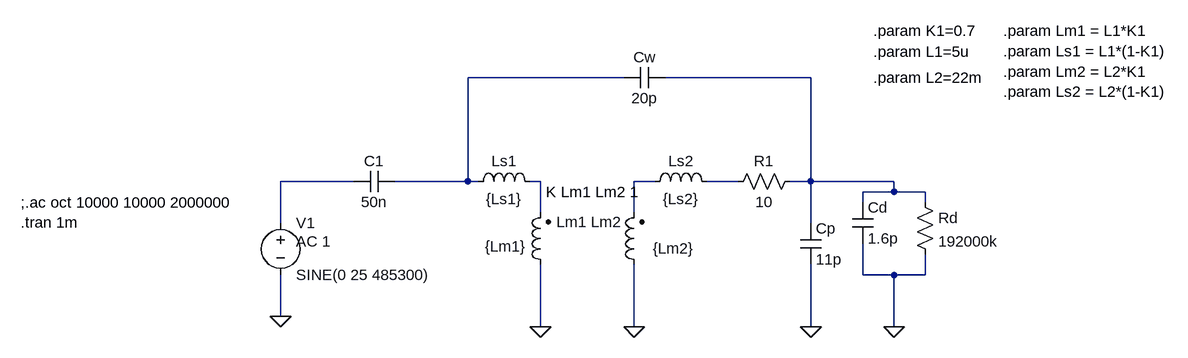
[diagram p0: schematic resonant_H_bridge - linear.asc]
resonant_H_bridge - linear.asc, the LTspice schematic file:
Version 4
SHEET 1 1716 680
WIRE 848 -352 608 -352
WIRE 1136 -352 912 -352
WIRE 432 -192 320 -192
WIRE 608 -192 608 -352
WIRE 608 -192 496 -192
WIRE 624 -192 608 -192
WIRE 720 -192 704 -192
WIRE 896 -192 864 -192
WIRE 1024 -192 976 -192
WIRE 1136 -192 1136 -352
WIRE 1136 -192 1104 -192
WIRE 1264 -192 1136 -192
WIRE 1264 -176 1264 -192
WIRE 1264 -176 1216 -176
WIRE 1312 -176 1264 -176
WIRE 1216 -160 1216 -176
WIRE 1312 -160 1312 -176
WIRE 720 -144 720 -192
WIRE 864 -144 864 -192
WIRE 320 -128 320 -192
WIRE 1136 -128 1136 -192
WIRE 1216 -48 1216 -96
WIRE 1264 -48 1216 -48
WIRE 1312 -48 1312 -80
WIRE 1312 -48 1264 -48
WIRE 320 16 320 -48
WIRE 720 32 720 -64
WIRE 864 32 864 -64
WIRE 1136 32 1136 -64
WIRE 1264 32 1264 -48
FLAG 1264 32 0
FLAG 1136 32 0
FLAG 864 32 0
FLAG 720 32 0
FLAG 320 16 0
SYMBOL ind2 736 -48 R180
WINDOW 0 -56 82 Left 2
WINDOW 3 38 44 Left 2
SYMATTR InstName Lm1
SYMATTR Value {Lm1}
SYMATTR Type ind
SYMBOL ind2 880 -48 R180
WINDOW 0 35 82 Left 2
WINDOW 3 -77 41 Left 2
SYMATTR InstName Lm2
SYMATTR Value {Lm2}
SYMATTR Type ind
SYMBOL res 1120 -208 R90
WINDOW 0 0 56 VBottom 2
WINDOW 3 32 56 VTop 2
SYMATTR InstName R1
SYMATTR Value 10
SYMBOL cap 1120 -128 R0
SYMATTR InstName Cp
SYMATTR Value 11p
SYMBOL cap 1200 -160 R0
SYMATTR InstName Cd
SYMATTR Value 1.6p
SYMBOL res 1296 -176 R0
SYMATTR InstName Rd
SYMATTR Value 192000k
SYMBOL cap 496 -208 R90
WINDOW 0 0 32 VBottom 2
WINDOW 3 32 32 VTop 2
SYMATTR InstName C1
SYMATTR Value 50n
SYMBOL voltage 320 -144 R0
WINDOW 123 24 44 Left 2
WINDOW 39 0 0 Left 0
SYMATTR Value2 AC 1
SYMATTR InstName V1
SYMATTR Value SINE(0 25 485300)
SYMBOL cap 912 -368 R90
WINDOW 0 0 32 VBottom 2
WINDOW 3 32 32 VTop 2
SYMATTR InstName Cw
SYMATTR Value 20p
SYMBOL ind 608 -176 R270
WINDOW 0 32 56 VTop 2
WINDOW 3 5 56 VBottom 2
SYMATTR InstName Ls1
SYMATTR Value {Ls1}
SYMBOL ind 880 -176 R270
WINDOW 0 32 56 VTop 2
WINDOW 3 5 56 VBottom 2
SYMATTR InstName Ls2
SYMATTR Value {Ls2}
TEXT 728 -176 Left 2 !K Lm1 Lm2 1
TEXT -80 -160 Left 2 !;.ac oct 10000 10000 2000000\n.tran 1m
TEXT 1232 -424 Left 2 !.param K1=0.7
TEXT 1432 -424 Left 2 !.param Lm1 = L1*K1\n.param Ls1 = L1*(1-K1)\n.param Lm2 = L2*K1\n.param Ls2 = L2*(1-K1)
TEXT 1232 -392 Left 2 !.param L1=5u
TEXT 1232 -352 Left 2 !.param L2=22m

The netlist it stands for:
* resonant_H_bridge - linear.asc
Lm1 0 N004 {Lm1}
Lm2 0 N005 {Lm2}
R1 N002 N006 10
Cp N002 0 11p
Cd N002 0 1.6p
Rd N002 0 192000k
C1 N001 N003 50n
V1 N003 0 SINE(0 25 485300) AC 1
Cw N002 N001 20p
Ls1 N001 N004 {Ls1}
Ls2 N005 N006 {Ls2}
K Lm1 Lm2 1
;.ac oct 10000 10000 2000000
.tran 1m
.param K1=0.7
.param Lm1 = L1*K1
.param Ls1 = L1*(1-K1)
.param Lm2 = L2*K1
.param Ls2 = L2*(1-K1)
.param L1=5u
.param L2=22m
.backanno
.end